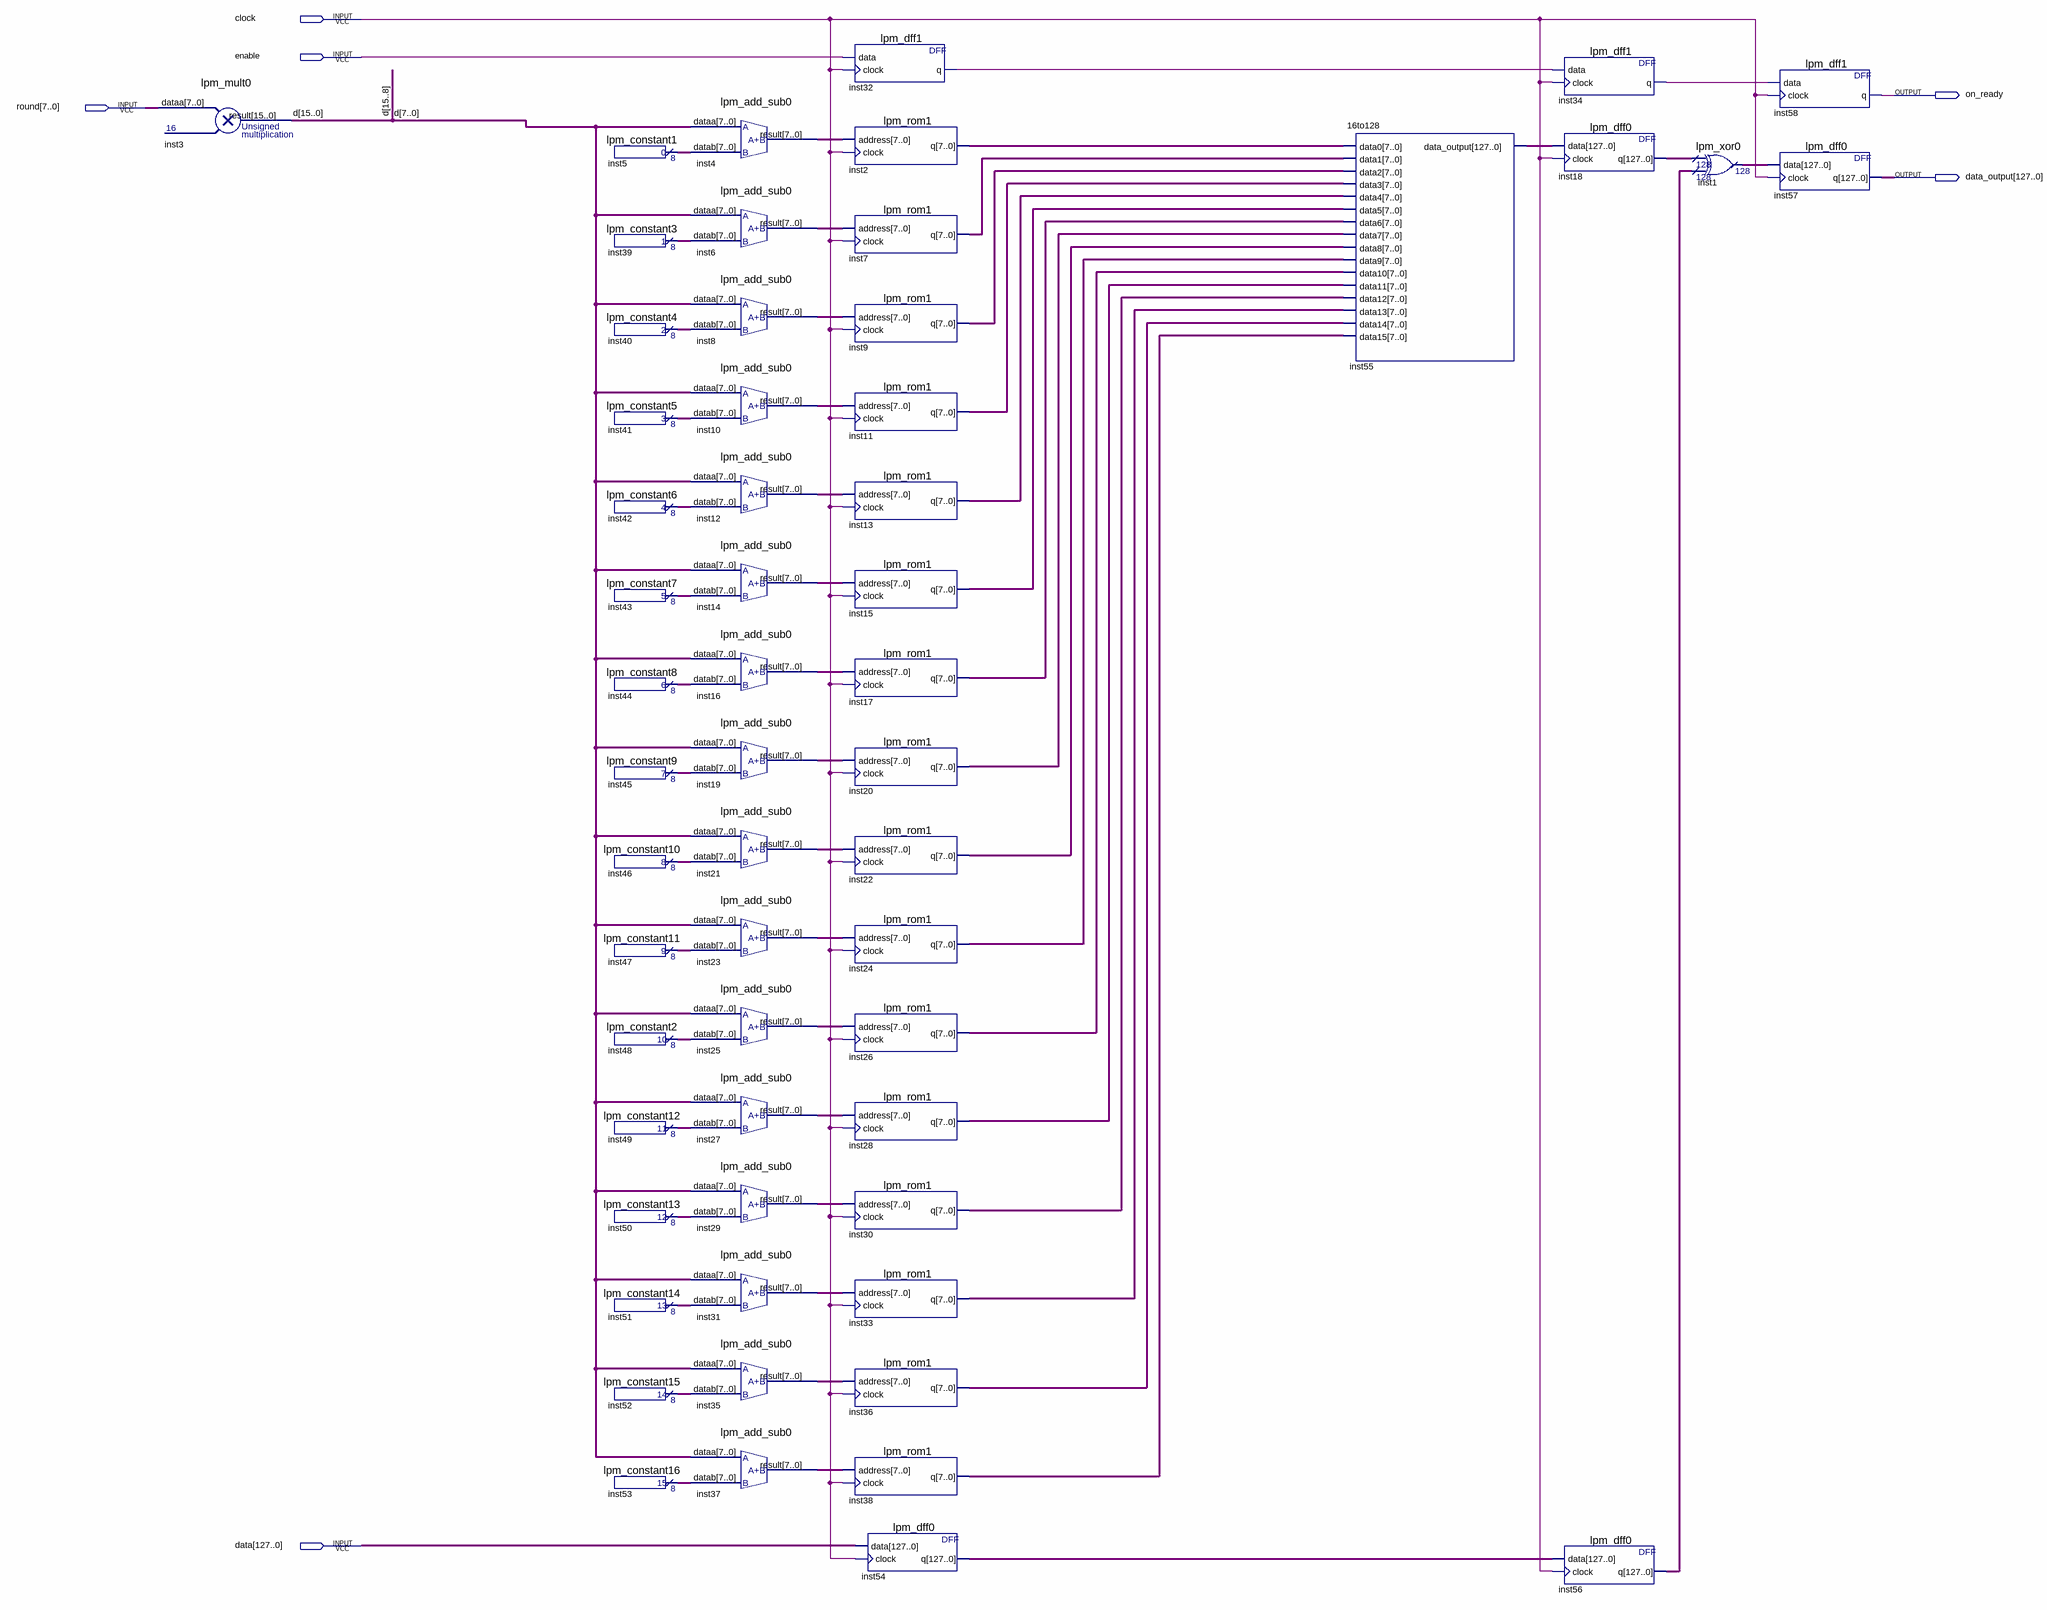
[diagram p0: schematic sheet]
// Quartus schematic add_round_key.bdf as structural Verilog: 58 symbols, 6 pins
module add_round_key (
  input  clock,
  input  enable,
  input  [7:0] round,
  input  [127:0] data,
  output on_ready,
  output [127:0] data_output
);

  wire inst32_q, inst34_q;
  wire [7:0] inst2_q, inst4_result, inst5_result, inst6_result, inst7_q, inst8_result, inst9_q,
       inst10_result, inst11_q, inst12_result, inst13_q, inst14_result, inst15_q, inst16_result, inst17_q,
       inst19_result, inst20_q, inst21_result, inst22_q, inst23_result, inst24_q, inst25_result, inst26_q,
       inst27_result, inst28_q, inst29_result, inst30_q, inst31_result, inst33_q, inst35_result, inst36_q,
       inst37_result, inst38_q, inst39_result, inst40_result, inst41_result, inst42_result, inst43_result,
       inst44_result, inst45_result, inst46_result, inst47_result, inst48_result, inst49_result,
       inst50_result, inst51_result, inst52_result, inst53_result;
  wire [15:0] d;
  wire [127:0] inst1_result, inst18_q, inst54_q, inst55_data_output, inst56_q;

  lpm_mult0 inst3 (.dataa(round), .result(d));
  lpm_constant1 inst5 (.result(inst5_result));
  lpm_constant3 inst39 (.result(inst39_result));
  lpm_constant4 inst40 (.result(inst40_result));
  lpm_constant5 inst41 (.result(inst41_result));
  lpm_constant6 inst42 (.result(inst42_result));
  lpm_constant7 inst43 (.result(inst43_result));
  lpm_constant8 inst44 (.result(inst44_result));
  lpm_constant9 inst45 (.result(inst45_result));
  lpm_constant10 inst46 (.result(inst46_result));
  lpm_constant11 inst47 (.result(inst47_result));
  lpm_constant2 inst48 (.result(inst48_result));
  lpm_constant12 inst49 (.result(inst49_result));
  lpm_constant13 inst50 (.result(inst50_result));
  lpm_constant14 inst51 (.result(inst51_result));
  lpm_constant15 inst52 (.result(inst52_result));
  lpm_constant16 inst53 (.result(inst53_result));
  lpm_add_sub0 inst4 (.dataa(d[7:0]), .datab(inst5_result), .result(inst4_result));
  lpm_add_sub0 inst6 (.dataa(d[7:0]), .datab(inst39_result), .result(inst6_result));
  lpm_add_sub0 inst8 (.dataa(d[7:0]), .datab(inst40_result), .result(inst8_result));
  lpm_add_sub0 inst10 (.dataa(d[7:0]), .datab(inst41_result), .result(inst10_result));
  lpm_add_sub0 inst12 (.dataa(d[7:0]), .datab(inst42_result), .result(inst12_result));
  lpm_add_sub0 inst14 (.dataa(d[7:0]), .datab(inst43_result), .result(inst14_result));
  lpm_add_sub0 inst16 (.dataa(d[7:0]), .datab(inst44_result), .result(inst16_result));
  lpm_add_sub0 inst19 (.dataa(d[7:0]), .datab(inst45_result), .result(inst19_result));
  lpm_add_sub0 inst21 (.dataa(d[7:0]), .datab(inst46_result), .result(inst21_result));
  lpm_add_sub0 inst23 (.dataa(d[7:0]), .datab(inst47_result), .result(inst23_result));
  lpm_add_sub0 inst25 (.dataa(d[7:0]), .datab(inst48_result), .result(inst25_result));
  lpm_add_sub0 inst27 (.dataa(d[7:0]), .datab(inst49_result), .result(inst27_result));
  lpm_add_sub0 inst29 (.dataa(d[7:0]), .datab(inst50_result), .result(inst29_result));
  lpm_add_sub0 inst31 (.dataa(d[7:0]), .datab(inst51_result), .result(inst31_result));
  lpm_add_sub0 inst35 (.dataa(d[7:0]), .datab(inst52_result), .result(inst35_result));
  lpm_add_sub0 inst37 (.dataa(d[7:0]), .datab(inst53_result), .result(inst37_result));
  lpm_dff1 inst32 (.data(enable), .clock(clock), .q(inst32_q));
  lpm_rom1 inst2 (.address(inst4_result), .clock(clock), .q(inst2_q));
  lpm_rom1 inst7 (.address(inst6_result), .clock(clock), .q(inst7_q));
  lpm_rom1 inst9 (.address(inst8_result), .clock(clock), .q(inst9_q));
  lpm_rom1 inst11 (.address(inst10_result), .clock(clock), .q(inst11_q));
  lpm_rom1 inst13 (.address(inst12_result), .clock(clock), .q(inst13_q));
  lpm_rom1 inst15 (.address(inst14_result), .clock(clock), .q(inst15_q));
  lpm_rom1 inst17 (.address(inst16_result), .clock(clock), .q(inst17_q));
  lpm_rom1 inst20 (.address(inst19_result), .clock(clock), .q(inst20_q));
  lpm_rom1 inst22 (.address(inst21_result), .clock(clock), .q(inst22_q));
  lpm_rom1 inst24 (.address(inst23_result), .clock(clock), .q(inst24_q));
  lpm_rom1 inst26 (.address(inst25_result), .clock(clock), .q(inst26_q));
  lpm_rom1 inst28 (.address(inst27_result), .clock(clock), .q(inst28_q));
  lpm_rom1 inst30 (.address(inst29_result), .clock(clock), .q(inst30_q));
  lpm_rom1 inst33 (.address(inst31_result), .clock(clock), .q(inst33_q));
  lpm_rom1 inst36 (.address(inst35_result), .clock(clock), .q(inst36_q));
  lpm_rom1 inst38 (.address(inst37_result), .clock(clock), .q(inst38_q));
  lpm_dff0 inst54 (.data(data), .clock(clock), .q(inst54_q));
  \16to128  inst55 (
    .data0(inst2_q), .data1(inst7_q), .data2(inst9_q), .data3(inst11_q), .data4(inst13_q), .data5(inst15_q),
    .data6(inst17_q), .data7(inst20_q), .data8(inst22_q), .data9(inst24_q), .data10(inst26_q),
    .data11(inst28_q), .data12(inst30_q), .data13(inst33_q), .data14(inst36_q), .data15(inst38_q),
    .data_output(inst55_data_output));
  lpm_dff1 inst34 (.data(inst32_q), .clock(clock), .q(inst34_q));
  lpm_dff0 inst18 (.data(inst55_data_output), .clock(clock), .q(inst18_q));
  lpm_dff0 inst56 (.data(inst54_q), .clock(clock), .q(inst56_q));
  lpm_xor0 inst1 (.data0x(inst18_q), .data1x(inst56_q), .result(inst1_result));
  lpm_dff1 inst58 (.data(inst34_q), .clock(clock), .q(on_ready));
  lpm_dff0 inst57 (.data(inst1_result), .clock(clock), .q(data_output));
endmodule
